# EAGLE design TEH (EAGLE 7.3.0)
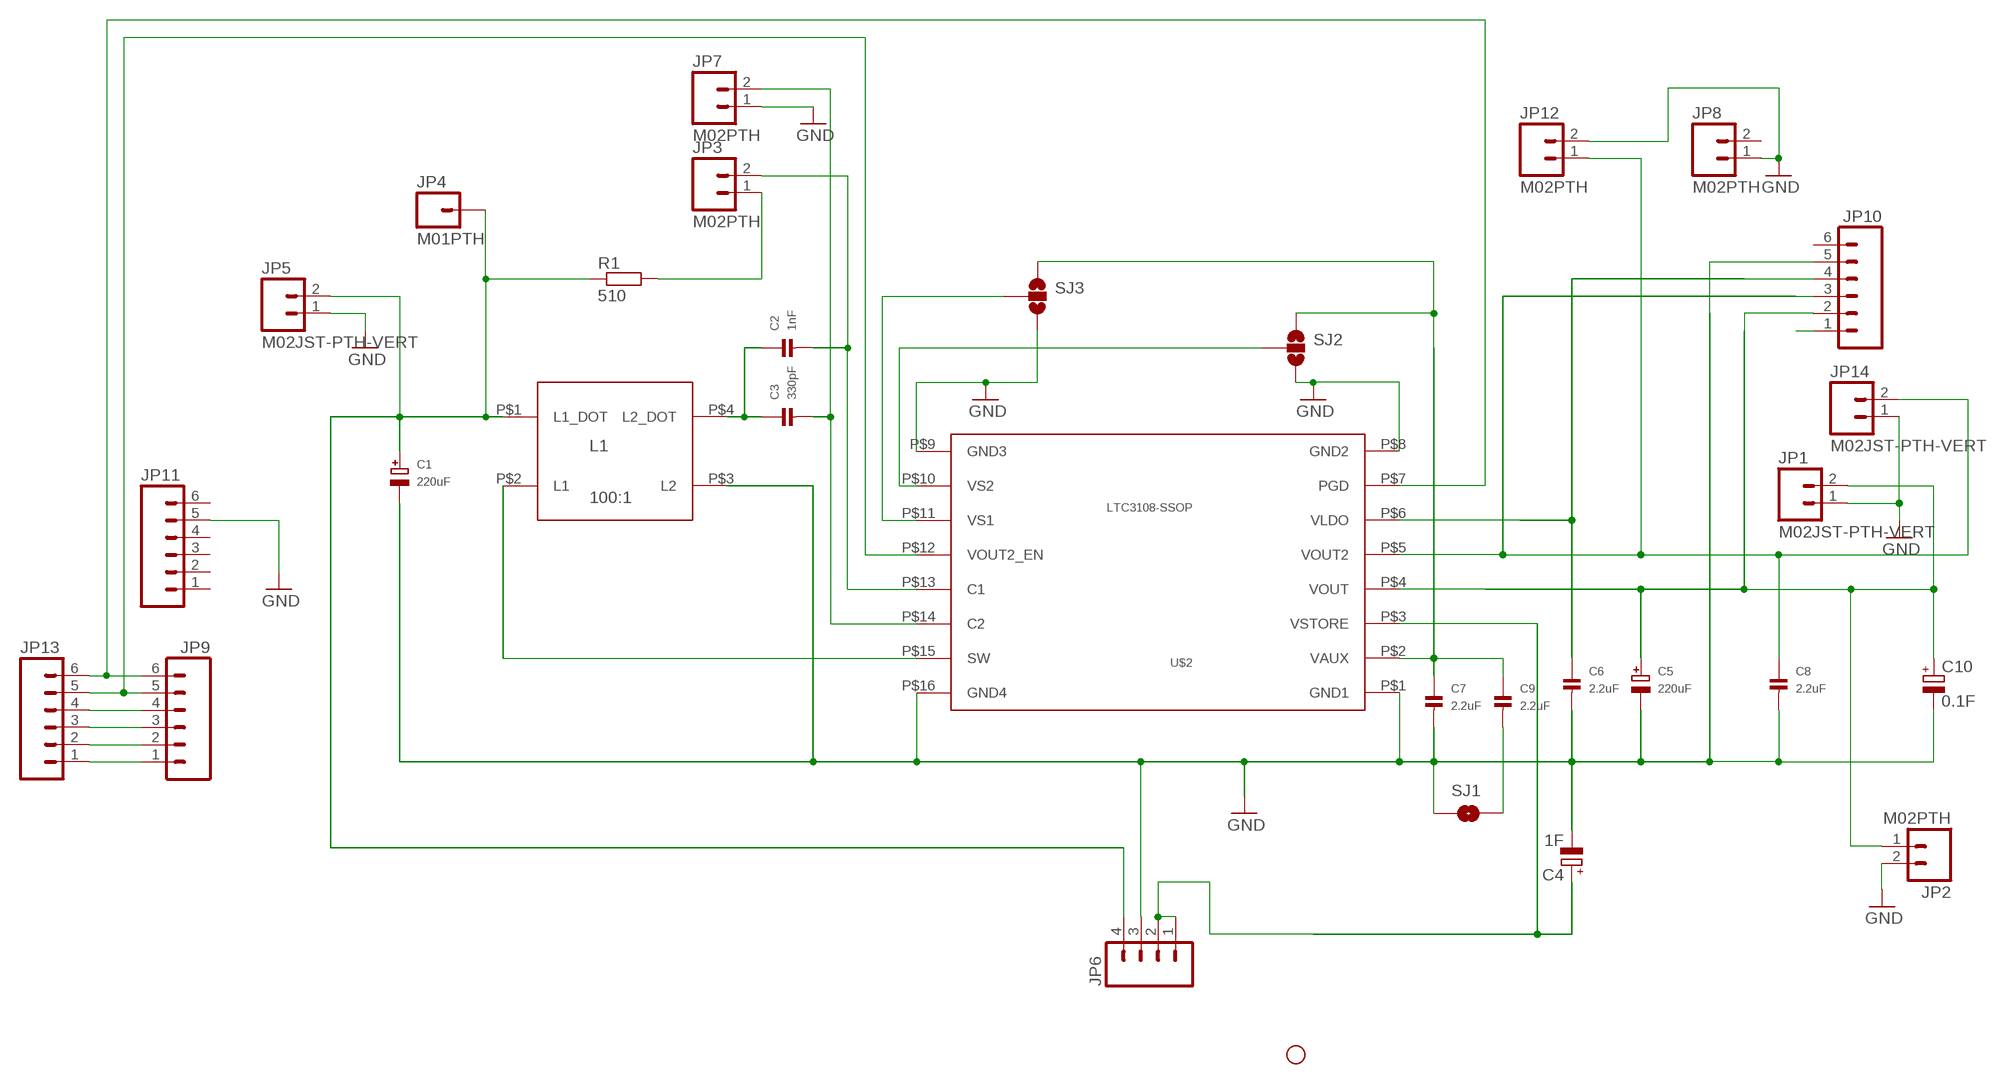
[diagram p0: schematic, sheet 1]

## Parts
C1  220uF  CAP_TANTALUMD/7343_REFLOW  [EIA7343-31/D-R]
C2  1nF  CAP_CERAMIC0805  [0805]
C3  330pF  CAP_CERAMIC0805  [0805]
C4  1F  CPOL-EUE5-13  [E5-13]
C5  220uF  CAP_TANTALUMD/7343_REFLOW  [EIA7343-31/D-R]
C6  2.2uF  CAP_CERAMIC0805  [0805]
C7  2.2uF  CAP_CERAMIC0805  [0805]
C8  2.2uF  CAP_CERAMIC0805  [0805]
C9  2.2uF  CAP_CERAMIC0805  [0805]
C10  0.1F  CPOL-EUE5-13  [E5-13]
JP1  M02JST-PTH-VERT  [JST-2-PTH-VERT]
JP2  M02PTH  [1X02]
JP3  M02PTH  [1X02]
JP4  M01PTH  [1X01]
JP5  M02JST-PTH-VERT  [JST-2-PTH-VERT]
JP6  M04PTH  [1X04]
JP7  M02PTH  [1X02]
JP8  M02PTH  [1X02]
JP9  M06NO_SILK  [1X06_NO_SILK]
JP10  M06NO_SILK  [1X06_NO_SILK]
JP11  M06NO_SILK  [1X06_NO_SILK]
JP12  M02PTH  [1X02]
JP13  M06NO_SILK  [1X06_NO_SILK]
JP14  M02JST-PTH-VERT  [JST-2-PTH-VERT]
L1  100:1  COILCRAFT_LPR6235-752SML  [COILCRAFT_LPR6235]
R1  510  R-EU_R0805  [R0805]
SJ1  JUMPER-PAD-2-NOYES_SILK  [PAD-JUMPER-2-NO_YES_SILK]
SJ2  SOLDERJUMPER_2WAYT  [SJ_2]
SJ3  SOLDERJUMPER_2WAYT  [SJ_2]
STANDOFF2  STAND-OFFTIGHT  [STAND-OFF-TIGHT]
U$2  LTC3108-SSOP  [SSOP-GN-16]

## Nets
GND: C1.- C4.- C5.- C6.2 C7.2 C8.2 C10.- JP1.1 JP2.2 JP5.1 JP6.3 JP7.1 JP8.1 JP10.5 JP11.5 JP12.2 JP14.1 L1.P$3(L2) SJ1.1 SJ2.3 SJ3.3 U$2.P$1(GND1) U$2.P$8(GND2) U$2.P$9(GND3) U$2.P$16(GND4)
N$1: C1.+ JP4.1 JP5.2 JP6.4 L1.P$1(L1_DOT) R1.1
N$2: L1.P$2(L1) U$2.P$15(SW)
N$3: C3.2 JP7.2 U$2.P$14(C2)
N$4: C5.+ C10.+ JP1.2 JP2.1 JP10.2 U$2.P$4(VOUT)
N$5: C2.1 C3.1 L1.P$4(L2_DOT)
N$6: C7.1 C9.1 SJ2.1 SJ3.1 U$2.P$2(VAUX)
N$7: C4.+ JP6.1 JP6.2 U$2.P$3(VSTORE)
N$8: JP9.6 JP13.6 U$2.P$7(PGD)
N$9: SJ3.2 U$2.P$11(VS1)
N$10: C6.1 JP10.4 U$2.P$6(VLDO)
N$11: JP9.5 JP13.5 U$2.P$12(VOUT2_EN)
N$12: JP10.1
N$13: C8.1 JP10.3 JP12.1 JP14.2 U$2.P$5(VOUT2)
N$14: SJ2.2 U$2.P$10(VS2)
N$15: C9.2 SJ1.2
N$17: C2.2 JP3.2 U$2.P$13(C1)
N$18: JP3.1 R1.2
N$20: JP9.4 JP13.4
N$21: JP9.3 JP13.3
N$22: JP9.2 JP13.2
N$23: JP9.1 JP13.1
Unconnected: JP8.2 JP10.6 JP11.1 JP11.2 JP11.3 JP11.4 JP11.6

## Library data of the parts
C1 C5 = microbuilder:CAP_TANTALUM: Tantalum Capacitors Wave footprints have larger pads and are meant to be used for hand soldering. Reflow footprints are optimised for solder paste and a reflow oven. EIA3216-18/A-[R/W] - Size A / 3216-18 / 1206 footprint 4.7µF 25V 10% Tantalum Capacitor 10µF 16V 10% Tantalum Capacitor [Digikey: 495-2236-2-ND] EIA3528-21/B-[R/W] - Size B / 3528-21 47µF 10V 10% Tantalum Capactior [Digikey: 495-2216-1-ND] EIA6032-28/C-[R/W] - Size C / 6032-28 10µF 35V 20% Tantalum Capacitor [Digikey: 495-2285-1-ND] 100µF 16V 10% Tantalum Capactior [Digikey: 399-5214-1-ND]
C2 C3 C6-C9 = microbuilder:CAP_CERAMIC: Ceramic Capacitors 0402 - 0402 Surface Mount Capacitors 0.1uF 10V 10% [Digikey: 490-1318-2-ND] 0603 - 0603 Surface Mount Capacitors 16 pF 50V 5% [Digikey: 445-5051-2-ND] 22 pF 50V [Digikey: PCC220ACVTR-ND] 33 pF 50V 5% [Digikey: 490-1415-1-ND] 56pF 50V 5% [Digikey: 490-1421-1-ND] 220pF 50V 5% [Digikey: 445-1285-1-ND] 680 pF 50V 2200 pF 50V 5% C0G [Digikey: 445-1297-1-ND] 5600 pF 100V 5% X7R [Digikey: 478-3711-1-ND] 0.1 µF 25V 10% [Digikey: PCC2277TR-ND] 0.22 µF 16V 10% X7R [Digikey: 445-1318-1-ND] 1.0 µF 25V 10% [Digikey: 445-5146-2-ND] 0603 - RF Specific 3pF 250V +/-0.1pF RF [Digikey: 712-1347-1-ND] 18 pF 250V 5% [Digikey: 478-3505-1-ND or 712-1322-1-ND] 56 pF 250V 5% C0G RF [Digikey: 490-4867-1-ND] 68 pF 250V RF [Digikey: 490-4868-1-ND] 0805 - 0805 Surface Mount Capacitors 220 pF 250V 2% RF Ceramic Capacitor [Digikey: 712-1398-1-ND] 1000 pF 50V 2% NP0 Ceramic Capacitor [Digikey: 478-3760-1-ND] 0.1 µF 25V 10% Ceramic Capacitor [Digikey: PCC1828TR-ND] 1.0 µF 16V 10% Ceramic Capacitor[Digikey: 490-1691-2-ND] 10.0 µF 10V 10% Ceramic Capacitor[Digikey: 709-1228-1-ND] 1206 - 1206 Surface Mount Capacitors
C4 C10 = rcl:CPOL-EU: POLARIZED CAPACITOR, European symbol
JP1-JP3 JP5 JP7 JP8 JP12 JP14 = SparkFun-Connectors:M02: Standard 2-pin 0.1" header. Use with - straight break away headers ( PRT-00116) - right angle break away headers (PRT-00553) - swiss pins (PRT-00743) - machine pins (PRT-00117) - female headers (PRT-00115) Molex polarized connector foot print use with: PRT-08233 with associated crimp pins and housings. 2.54_SCREWTERM for use with PRT-10571. 3.5mm Screw Terminal footprints for PRT-08084 5mm Screw Terminal footprints for use with PRT-08432
JP4 = SparkFun-Connectors:M01: Header 1 Standard 1-pin 0.1" header. Use with straight break away headers (SKU : PRT-00116), right angle break away headers (PRT-00553), swiss pins (PRT-00743), machine pins (PRT-00117), and female headers (PRT-00115).
JP6 = SparkFun-Connectors:M04: Header 4 Standard 4-pin 0.1" header. Use with straight break away headers (SKU : PRT-00116), right angle break away headers (PRT-00553), swiss pins (PRT-00743), machine pins (PRT-00117), and female headers (PRT-00115). Molex polarized connector foot print use with SKU : PRT-08231 with associated crimp pins and housings. 1MM SMD Version SKU: PRT-10208
JP9-JP11 JP13 = SparkFun-Connectors:M06: Header 6 Standard 6-pin 0.1" header. Use with straight break away headers (SKU : PRT-00116), right angle break away headers (PRT-00553), swiss pins (PRT-00743), machine pins (PRT-00117), and female headers (PRT-00115). Molex polarized connector foot print use with SKU : PRT-08094 with associated crimp pins and housings. NOTES ON THE VARIANTS LOCK and LOCK_LONGPADS... This footprint was designed to help hold the alignment of a through-hole component (i.e. 6-pin header) while soldering it into place. You may notice that each hole has been shifted either up or down by 0.005 of an inch from it's more standard position (which is a perfectly straight line). This slight alteration caused the pins (the squares in the middle) to touch the edges of the holes. Because they are alternating, it causes a "brace" to hold the component in place. 0.005 has proven to be the perfect amount of "off-center" position when using our standard breakaway headers. Although looks a little odd when you look at the bare footprint, once you have a header in there, the alteration is very hard to notice. Also,if you push a header all the way into place, it is covered up entirely on the bottom side. This idea of altering the position of holes to aid alignment will be further integrated into the Sparkfun Library for other footprints. It can help hold any component with 3 or more connection pins.
L1 = wa7iut:COILCRAFT_LPR6235-752SML: Coil Craft LPR6235-752SML
R1 = rcl:R-EU_: RESISTOR, European symbol
SJ1 = SparkFun-Passives:JUMPER-PAD-2-NO
SJ2 SJ3 = SparkFun-Retired:SOLDERJUMPER_2WAY: Solder Jumper 2 way solder jumper
STANDOFF2 = SparkFun-Electromechanical:STAND-OFF: #4 Stand Off This is the mechanical footprint for a #4 phillips button head screw. Use the keepout ring to avoid running the screw head into surrounding components. SKU : PRT-00447
U$2 = wa7iut:LTC3108-SSOP: LTC3108 in16 pin SSOP Narrow GN Package

## Board
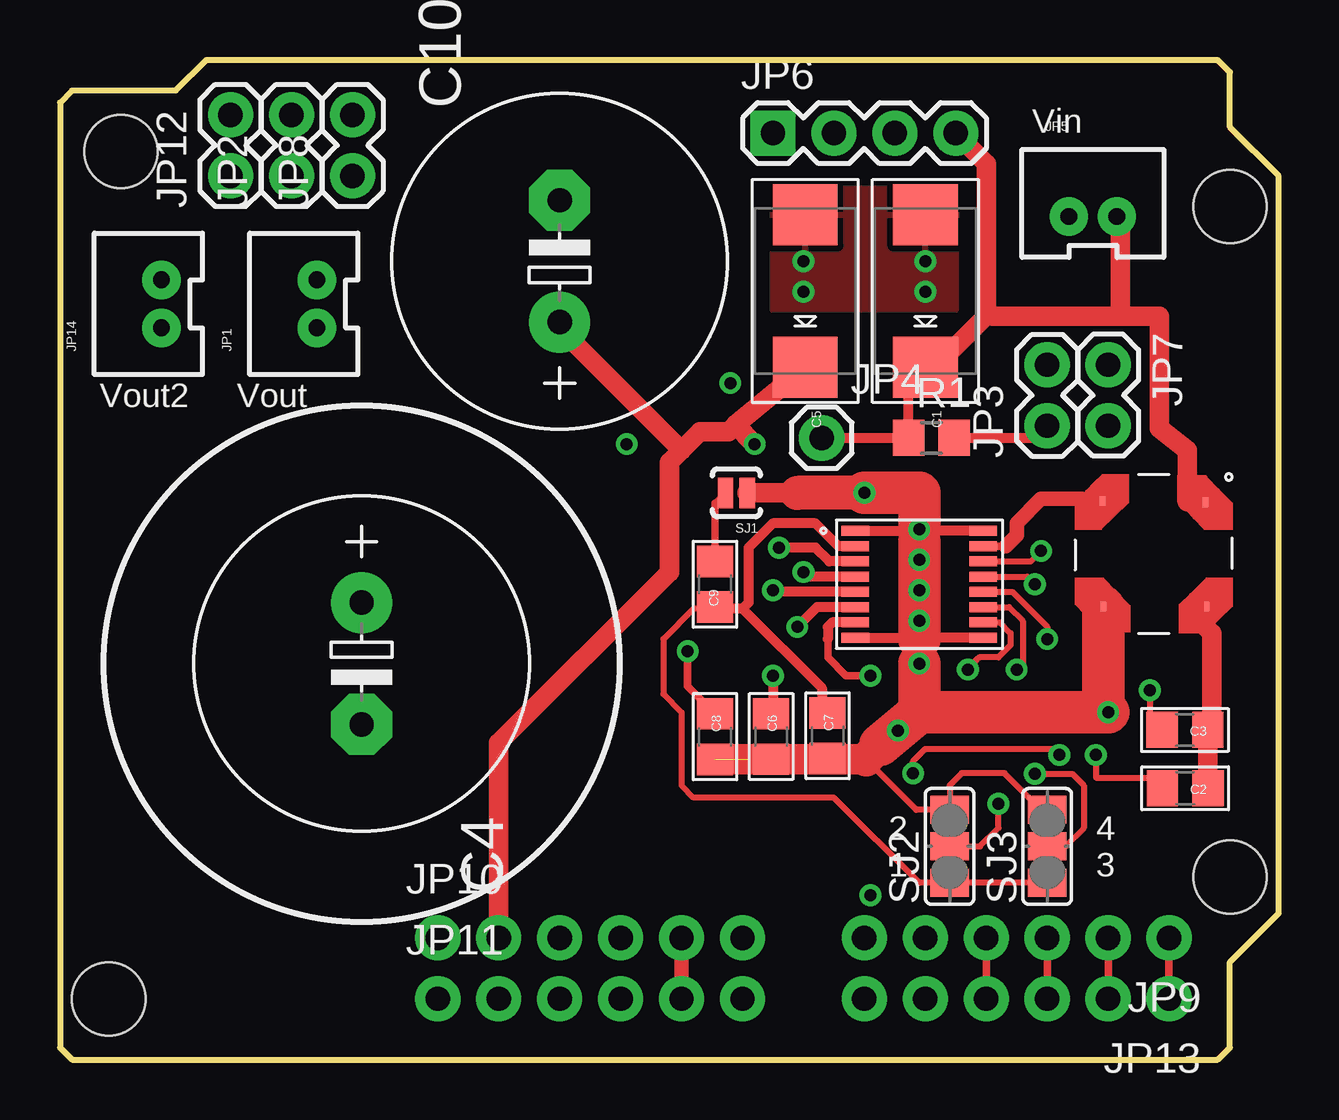
[diagram p1: board, top side]
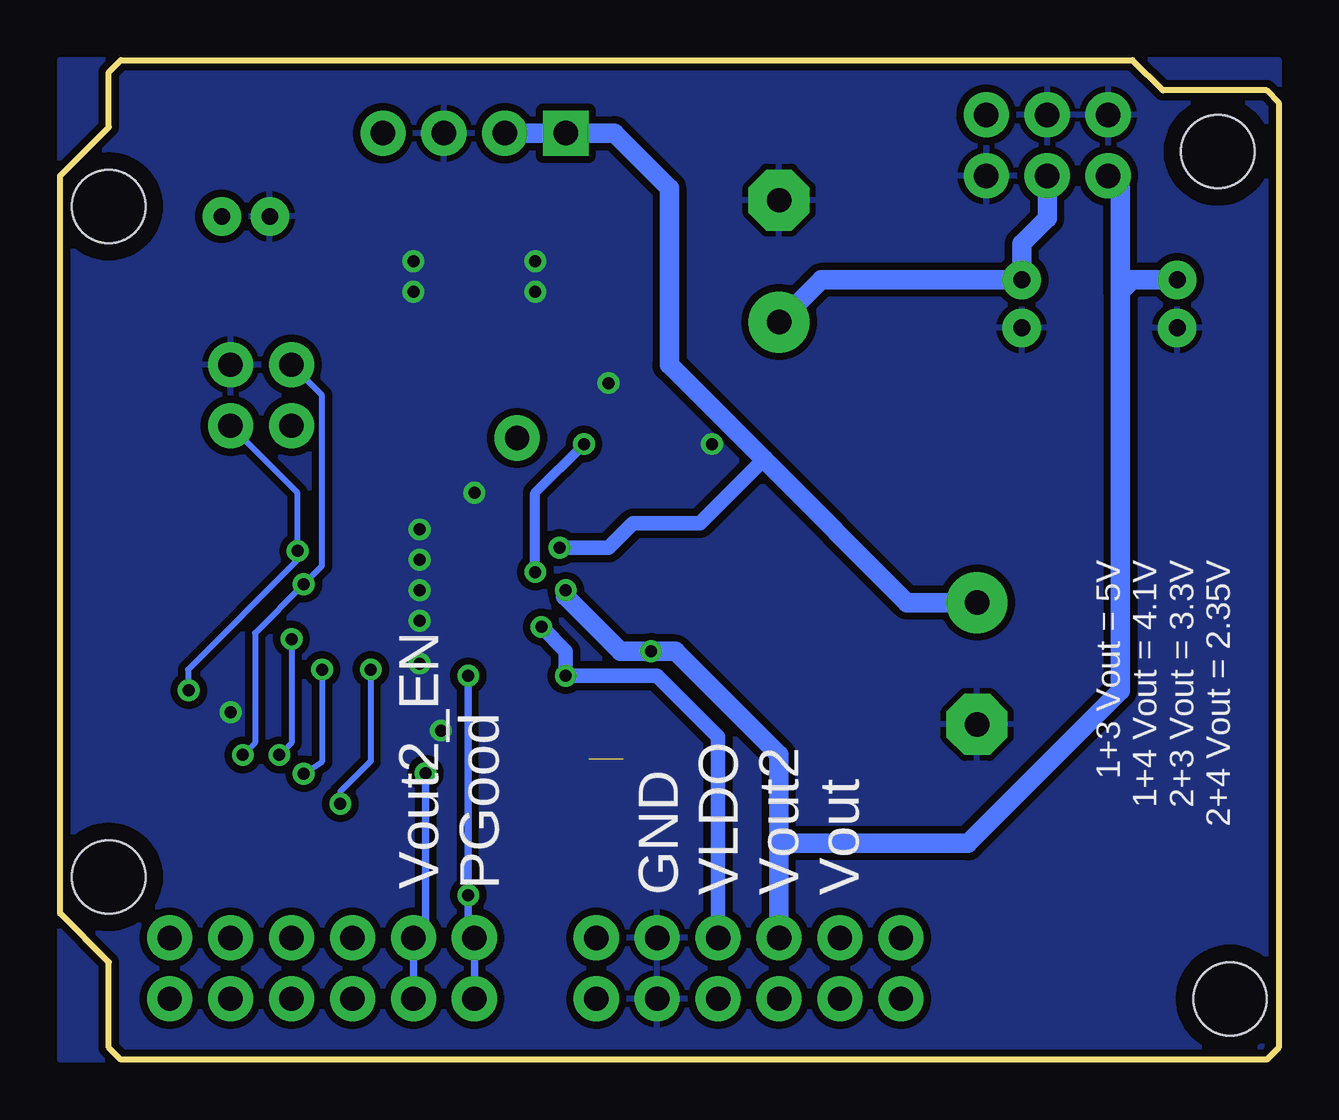
[diagram p2: board, bottom side, seen from below]

Size 50.8 x 41.66 mm. Coordinates in mm from the lower left corner, seen from the top.
Outline: 0.51,0 48.26,0 48.77,0.51 48.77,4.06 50.8,6.1 50.8,36.83 48.77,38.86 48.77,41.15 48.26,41.66 6.1,41.66 4.83,40.39 0.51,40.39 0,39.88 0,0.51 0.51,0
Copper layers (1*16): Top 0.035mm / dielectric 1.5mm / Bottom 0.035mm
Design rules "default *": minimum track width 10mil, minimum drill 24mil, track to track 8mil, track to pad 8mil, pad to pad 8mil, via to via 8mil, smd to smd 8mil, copper to edge 10mil, drill to drill 8mil, minimum pad ring 10mil, minimum via ring 8mil, stop-mask expansion 4mil, vias tented up to drill 0mil, thermal gap 10mil

### Footprints (pad centres in the part's own frame; a part is rotated, then mirrored left to right if it is on the bottom)
EIA7343-31/D-R = smd 2.55 x 2.7: + 3.175,0; - -3.175,0
0805 = smd 1.3 x 1.5: 1 -0.95,0; 2 0.95,0
E5-13 = drill 1.016 pad 2.54: + -2.54,0 | drill 1.016 pad 2.54 octagon: - 2.54,0
JST-2-PTH-VERT = drill 0.7 pad 1.6: 1 -1,-0.55; 2 1,-0.55
1X02 = drill 1.016 pad 1.88: 1 0,0; 2 2.54,0
1X01 = drill 1.016 pad 1.88: 1 0,0
1X04 = drill 1.016 pad 1.88 square: 1 0,0 | drill 1.016 pad 1.88: 2 2.54,0; 3 5.08,0; 4 7.62,0
1X06_NO_SILK = drill 1.016 pad 1.88: 1 0,0; 2 2.54,0; 3 5.08,0; 4 7.62,0; 5 10.16,0; 6 12.7,0
COILCRAFT_LPR6235 = smd 0.406 x 0.203: P$1 -2.15,2.15; P$2 -2.2,-2.15; P$3 2.2,-2.1; P$4 2.2,2.2
R0805 = smd 1.3 x 1.5: 1 -0.95,0; 2 0.95,0
PAD-JUMPER-2-NO_YES_SILK = smd 0.635 x 1.27: 1 -0.45,0; 2 0.45,0
SJ_2 = smd 1.168 x 1.6: 1 -1.524,0; 2 0,0; 3 1.524,0
STAND-OFF-TIGHT = hole 3.048: 0,0
SSOP-GN-16 = smd 0.419 x 1.143: P$1 -2.222,-2.662; P$2 -1.587,-2.662; P$3 -0.952,-2.662; P$4 -0.317,-2.662; P$5 0.318,-2.662; P$6 0.953,-2.662; P$7 1.588,-2.662; P$8 2.223,-2.662; P$9 2.223,2.67; P$10 1.587,2.67; P$11 0.953,2.67; P$12 0.318,2.67; P$13 -0.318,2.67; P$14 -0.953,2.67; P$15 -1.587,2.67; P$16 -2.223,2.67

### Placement (x,y rotation side)
C1  36.07,32.03 270 top
C2  46.9,11.31 180 top
C3  46.89,13.74 180 top
C4  12.57,16.51 270 top
C5  31.06,32.03 270 top
C6  29.64,13.47 270 top
C7  31.99,13.5 270 top
C8  27.3,13.46 270 top
C9  27.3,19.81 90 top
C10  20.83,33.27 90 top
JP1  10.16,31.5 90 top
JP2  9.65,36.83 90 top
JP3  41.15,26.42 90 top
JP4  31.75,25.91 0 top
JP5  43.05,35.69 0 top
JP6  29.72,38.61 0 top
JP7  43.69,28.96 270 top
JP8  12.19,36.83 90 top
JP9  46.23,5.08 180 top
JP10  15.75,5.08 0 top
JP11  15.75,2.54 0 top
JP12  7.11,36.83 90 top
JP13  46.23,2.54 180 top
JP14  3.68,31.5 90 top
L1  45.59,21.08 270 top
R1  36.32,25.91 0 top
SJ1  28.19,23.62 180 top
SJ2  37.08,8.89 90 top
SJ3  41.15,8.89 90 top
STANDOFF1  STAND-OFF  [STAND-OFF-TIGHT]  2.54,37.85 0 top
STANDOFF2  2.03,2.54 0 top
STANDOFF3  STAND-OFF  [STAND-OFF-TIGHT]  48.77,7.62 0 top
STANDOFF4  STAND-OFF  [STAND-OFF-TIGHT]  48.77,35.56 0 top
U$2  35.81,19.81 270 top

### Tracks (layer width: path | path; a pad name or v marks a point on that pad's centre or on a via)
GND  (via drill 0.5)  (1 unrouted)
  Top 0.254: 35.88,17.59 35.81,17.53 35.75,17.59 | 35.37,22.03 35.81,21.59 | 35.88,22.04 v35.81,22.1 | SJ3.3 40.89,10.41 39.37,11.94 37.59,11.94 37.08,11.43 SJ2.3 35.69,10.41 33.59,12.51
  Top 0.406: U$2.P$8 35.75,17.59 | U$2.P$1 35.37,22.03 | U$2.P$16 35.88,22.04 | U$2.P$9 36.39,17.59 36.32,17.53 35.94,17.53 35.88,17.59
  Top 0.61: JP10.5 JP11.5
  Top 0.813: 28.75,12.51 C6.2 | SJ1.1 30.73,23.62
  Top 1.27: C8.2 31.2,12.51 | 31.2,12.51 C7.2 | 31.2,12.51 33.59,12.51
  Top 1.422: 35.81,17.53 v35.81,16.51 | v33.53,23.62 30.73,23.62 | v35.81,22.1 35.81,21.59 | 33.59,12.51 34.2,13.12
  Top 1.778: 35.81,17.53 v35.81,18.29 v35.81,19.56 v35.81,20.83 35.81,21.59 | v35.81,16.51 35.81,14.48 | 35.81,14.48 v43.69,14.48 43.49,14.73 L1.P$3 | v33.53,23.62 35.81,23.62 v35.81,22.1 | 34.2,13.12 35.81,14.48
  other vias: 30.99,32 36.07,32 36.07,33.27 30.99,33.27 27.94,28.19 27.94,28.19 23.62,25.65 23.62,25.65 23.62,25.65 34.92,13.72
  pour Bottom (isolate 0.305): 0,0 50.8,0 50.8,41.66 0,41.66
  pour Top: 29.72,36.32 37.34,36.32 37.34,31.24 29.72,31.24
N$1
  Top 0.406: JP4.1 R1.1 35.37,27.9 C1.+
  Top 0.813: L1.P$1 46.99,23.24 46.99,25.4 45.83,26.3 45.83,30.99 44.2,30.99 | 35.97,28.86 C1.+ 36.48,28.86 38.73,31.11 | 44.2,30.99 38.86,30.99 38.73,31.11 | JP6.4 38.61,37.34 38.61,31.24 38.73,31.11 | JP5.2 44.2,34.88 44.2,30.99
N$2
  Top 0.254: 42.59,23.37 L1.P$2
  Top 0.305: U$2.P$15 39.43,21.4
  Top 0.61: 39.43,21.4 39.88,21.84 39.88,22.35 40.89,23.37 42.59,23.37
N$3  (via drill 0.5)
  Top 0.254: U$2.P$14 40.46,20.77 v40.89,21.2 | v45.43,15.39 45.43,14.12 C3.2
  Bottom 0.254: v45.43,15.39 45.47,15.43 45.47,16.26 40.89,20.83 v40.89,21.2 40.89,23.62 JP7.2
N$4  (via drill 0.5)
  Top 0.254: 31.24,28.17 C5.+ 30.48,28.78
  Top 0.305: 31.18,20.13 v30.99,20.32
  Top 0.406: U$2.P$4 31.18,20.13
  Top 0.813: 25.91,25.4 25.4,24.89 25.4,20.32 18.29,13.21 JP10.2 | 25.91,25.4 26.67,26.16 27.86,26.16 28.16,26.45 | 28.16,26.45 C5.+ | v28.96,25.65 28.16,26.45 | C10.+ 20.83,30.48 25.91,25.4
  Bottom 0.406: v30.99,20.32 30.99,23.62 v28.96,25.65
  Bottom 0.813: C10.+ 19.07,32.5 JP1.2 10.71,33.99 9.65,35.05 JP2.1
N$5
  Top 0.813: L1.P$4 47.03,18.75 48.01,17.78 48.01,13.78 C3.1 47.84,11.46 C2.1
N$6
  Top 0.254: 27.37,18.8 C9.1 27.24,18.8 26.42,18.8 25.15,17.53 25.15,15.24 25.91,14.48 25.91,11.43 26.42,10.92 32.26,10.92 35.81,7.37 SJ2.1 SJ3.1 | 31.75,14.46 C7.1
  Top 0.406: 28.45,18.8 27.37,18.8 | 28.45,18.8 31.75,15.49 31.75,14.46 | U$2.P$2 32.45,21.4 31.5,22.35 29.72,22.35 28.7,21.34 28.7,19.05 28.45,18.8
N$7  (via drill 0.5)
  Top 0.406: v29.97,21.34 31.5,21.34 32.07,20.76 U$2.P$3
  Bottom 0.61: v29.97,21.34 27.94,21.34 26.92,22.35 24.13,22.35 21.46,25.02
  Bottom 0.813: JP6.2 JP6.1 27.69,38.61 25.4,36.32 25.4,28.96 21.46,25.02 15.49,19.05 C4.+
N$8  (via drill 0.5)
  Top 0.305: v33.78,16 32.77,16 32,16.76 32,17.53
  Top 0.406: U$2.P$7 32.19,18.22 32,18.03 32,17.53
  Bottom 0.305: v33.78,16 v33.78,6.86 33.78,5.33 JP9.6 JP13.6
N$9  (via drill 0.5)
  Top 0.254: U$2.P$11 39.56,18.86 40.13,18.29 40.13,16.51 v39.88,16.26 | v40.64,11.91 42.19,11.91 42.67,11.43 42.67,9.65 41.91,8.89 SJ3.2
  Bottom 0.254: v39.88,16.26 39.88,12.42 v40.64,11.91
N$10  (via drill 0.5)
  Top 0.254: 29.72,14.62 C6.1
  Top 0.406: v29.72,16 29.72,14.62 | U$2.P$6 31.56,18.86 v30.73,18.03
  Bottom 0.61: v30.73,18.03 29.72,17.02 v29.72,16 25.91,16 23.37,13.46 JP10.4
N$11  (via drill 0.5)
  Top 0.254: v35.56,11.94 35.56,12.45 36.07,12.95 41.4,12.95 v41.66,12.7 41.66,12.95 | U$2.P$12 39.69,19.49 41.15,18.03 v41.15,17.53
  Bottom 0.254: v41.15,17.53 41.15,13.21 v41.66,12.7
  Bottom 0.305: v35.56,11.94 35.56,5.59 JP9.5 JP13.5
N$13  (via drill 0.5)
  Top 0.254: 29.78,19.49 v29.72,19.56
  Top 0.305: v26.16,17.02 26.16,15.55 C8.1
  Top 0.406: U$2.P$5 29.78,19.49
  Bottom 0.813: v29.72,19.56 29.72,19.3 27.43,17.02 v26.16,17.02 25.15,17.02 20.83,12.7 20.83,8.64 | JP10.3 20.83,8.64 | JP14.2 6.11,32.5 6.6,32 | 6.6,32 6.6,15.37 12.95,9.02 20.45,9.02 20.83,8.64 | 6.6,32 6.6,36.32 JP12.1
N$14  (via drill 0.5)
  Top 0.254: v37.85,16.26 38.21,16.66 38.31,16.76 39.12,16.76 39.62,17.27 39.62,17.78 39.18,18.22 U$2.P$10 | SJ2.2 38.35,8.89 39.12,9.65 v39.12,10.67
  Bottom 0.254: v37.85,16.26 37.85,12.45 39.12,11.18 v39.12,10.67
N$15
  Top 0.254: 27.3,23.18 SJ1.2
  Top 0.305: C9.2 27.3,23.18
N$17  (via drill 0.5)
  Top 0.254: U$2.P$13 40.32,20.13 v40.64,19.81 | v43.18,12.7 43.18,11.75 45.64,11.75 C2.2
  Bottom 0.254: v43.18,12.7 42.67,13.21 42.67,17.78 v40.64,19.81 39.88,20.57 39.88,27.69 JP3.2
N$18
  Top 0.406: R1.2 40.64,25.91 JP3.1
N$20
  Top 0.305: JP13.4 JP9.4
N$21
  Top 0.305: JP9.3 JP13.3
N$22
  Top 0.305: JP13.2 JP9.2
N$23
  Top 0.305: JP9.1 JP13.1

### Text on the board
tPlace: Vin | Vout2 | Vout | 2 | 4 | 1 | 3
bNames: 1+3 Vout = 5V / 1+4 Vout = 4.1V / 2+3 Vout = 3.3V / 2+4 Vout = 2.35V | GND / VLDO / Vout2 / Vout | Vout2_EN / PGood